# EAGLE schematic eeZeeSwitch (EAGLE 6.4)
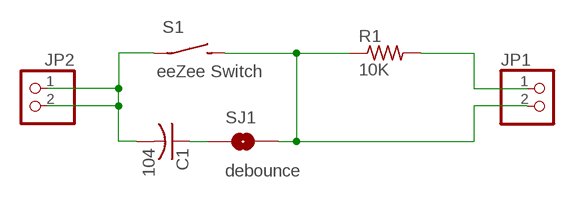
[diagram p0: schematic, sheet 1]

## Parts
C1  104  C-USC0603  [C0603]
JP1  PINHD-1X02_2.54-S  [1X02-S]
JP2  PINHD-1X02_2.54-S  [1X02-S]
R1  10K  R-US_R0603  [R0603]
S1  eeZee Switch  SPST_TAC_RECT1  [6MMTACTILE_RECT]
SJ1  debounce  SOLDERJUMPERNO  [SJ_2S-NO]

## Nets
N$1: JP1.2 R1.1 S1.P$2(S) SJ1.2
N$2: C1.2 JP2.1 JP2.2 S1.P$1(P)
N$3: JP1.1 R1.2
N$4: C1.1 SJ1.1

## Library data of the parts
C1 = rcl:C-US: CAPACITOR, American symbol
JP1 JP2 = pinhead-2:PINHD-1X02: PIN HEADER
R1 = rcl:R-US_: RESISTOR, American symbol
S1 = bt_electromech:SPST: SPST SWITCH
SJ1 = SparkFun:SOLDERJUMPER: Solder Jumper Standard SMD solder jumper. Used to automate production. Two varients : Normally Open and Normally Closed are the same, but have different paste layers. NC will have a large amount of paste and should jumper during reflow.